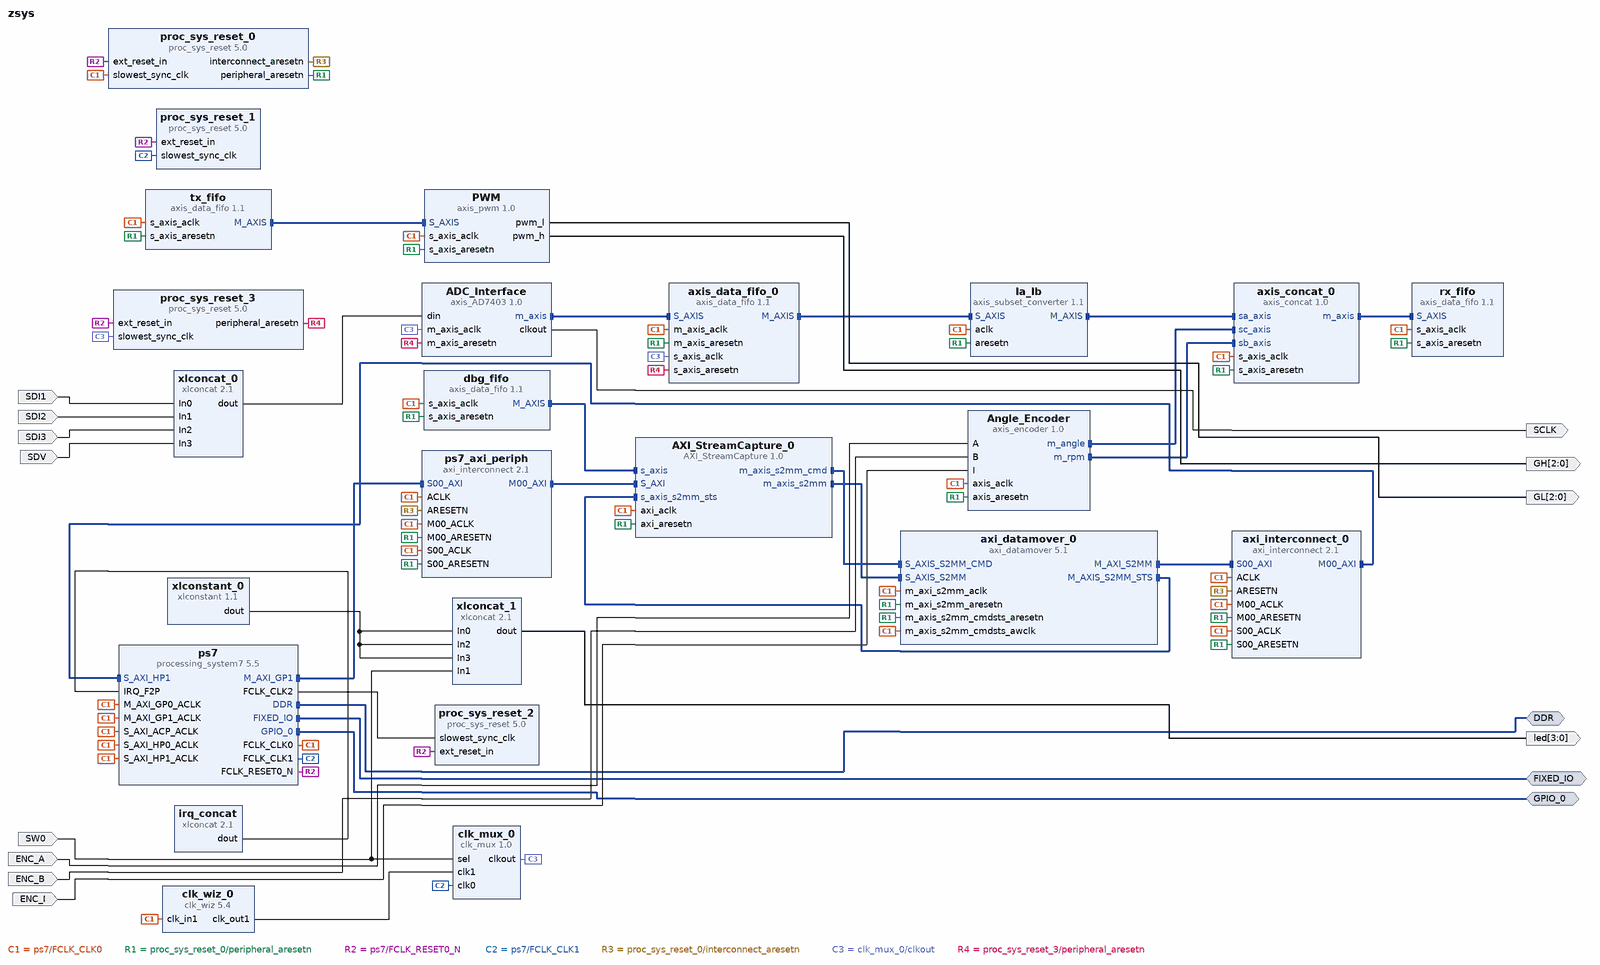
[diagram p0: block diagram of the top level]
# Vivado block design zsys, xc7z010clg400-1, Vivado 2017.1_sdx
create_bd_design zsys

create_bd_intf_port -mode Master -vlnv xilinx.com:interface:ddrx_rtl:1.0 DDR
create_bd_intf_port -mode Master -vlnv xilinx.com:display_processing_system7:fixedio_rtl:1.0 FIXED_IO
create_bd_intf_port -mode Master -vlnv xilinx.com:interface:gpio_rtl:1.0 GPIO_0
create_bd_port -dir I ENC_A
create_bd_port -dir I ENC_B
create_bd_port -dir I SDI1
create_bd_port -dir I SDI2
create_bd_port -dir I SDI3
create_bd_port -dir I SDV
create_bd_port -dir O SCLK
create_bd_port -dir O -from 2 -to 0 GL
create_bd_port -dir O -from 2 -to 0 GH
create_bd_port -dir I ENC_I
create_bd_port -dir O -from 3 -to 0 led
create_bd_port -dir I SW0

create_bd_cell -type ip -vlnv trenz.biz:user:axis_concat:1.0 axis_concat_0
set_property -dict {CONFIG.C_A_TDATA_WIDTH 32 CONFIG.M_TDATA_WIDTH 64 CONFIG.C_IN_CHANNELS 3} [get_bd_cells axis_concat_0]
create_bd_cell -type ip -vlnv xilinx.com:ip:axis_data_fifo:1.1 rx_fifo
set_property -dict {CONFIG.TDATA_NUM_BYTES 8 CONFIG.FIFO_DEPTH 512 CONFIG.IS_ACLK_ASYNC 0} [get_bd_cells rx_fifo]
create_bd_cell -type ip -vlnv xilinx.com:ip:processing_system7:5.5 ps7
set_property -dict [list \
  CONFIG.PCW_FCLK_CLK2_BUF TRUE \
  CONFIG.PCW_UIPARAM_DDR_FREQ_MHZ 525 \
  CONFIG.PCW_CRYSTAL_PERIPHERAL_FREQMHZ 50 \
  CONFIG.PCW_APU_PERIPHERAL_FREQMHZ 650 \
  CONFIG.PCW_SDIO_PERIPHERAL_FREQMHZ 50 \
  CONFIG.PCW_UART_PERIPHERAL_FREQMHZ 100 \
  CONFIG.PCW_FPGA0_PERIPHERAL_FREQMHZ 100 \
  CONFIG.PCW_FPGA1_PERIPHERAL_FREQMHZ 20 \
  CONFIG.PCW_USE_M_AXI_GP1 1 \
  CONFIG.PCW_USE_S_AXI_ACP 1 \
  CONFIG.PCW_USE_S_AXI_HP0 1 \
  CONFIG.PCW_USE_S_AXI_HP1 1 \
  CONFIG.PCW_M_AXI_GP0_FREQMHZ 10 \
  CONFIG.PCW_S_AXI_HP0_FREQMHZ 10 \
  CONFIG.PCW_USE_FABRIC_INTERRUPT 1 \
  CONFIG.PCW_GPIO_EMIO_GPIO_WIDTH 2 \
  CONFIG.PCW_EN_CLK1_PORT 1 \
  CONFIG.PCW_EN_CLK2_PORT 1 \
  CONFIG.PCW_IRQ_F2P_INTR 1 \
  CONFIG.PCW_PERIPHERAL_BOARD_PRESET None \
  CONFIG.PCW_PRESET_BANK1_VOLTAGE {LVCMOS 1.8V} \
  CONFIG.PCW_UIPARAM_DDR_BUS_WIDTH {16 Bit} \
  CONFIG.PCW_UIPARAM_DDR_PARTNO {MT41J256M16 RE-125} \
  CONFIG.PCW_QSPI_PERIPHERAL_ENABLE 1 \
  CONFIG.PCW_QSPI_QSPI_IO {MIO 1 .. 6} \
  CONFIG.PCW_QSPI_GRP_SINGLE_SS_ENABLE 1 \
  CONFIG.PCW_QSPI_GRP_SINGLE_SS_IO {MIO 1 .. 6} \
  CONFIG.PCW_QSPI_GRP_FBCLK_ENABLE 1 \
  CONFIG.PCW_QSPI_GRP_FBCLK_IO {MIO 8} \
  CONFIG.PCW_ENET0_PERIPHERAL_ENABLE 1 \
  CONFIG.PCW_ENET0_ENET0_IO {MIO 16 .. 27} \
  CONFIG.PCW_ENET0_GRP_MDIO_ENABLE 1 \
  CONFIG.PCW_ENET0_GRP_MDIO_IO {MIO 52 .. 53} \
  CONFIG.PCW_ENET_RESET_ENABLE 1 \
  CONFIG.PCW_ENET_RESET_SELECT {Share reset pin} \
  CONFIG.PCW_ENET0_RESET_ENABLE 1 \
  CONFIG.PCW_ENET0_RESET_IO {MIO 9} \
  CONFIG.PCW_SD0_PERIPHERAL_ENABLE 1 \
  CONFIG.PCW_SD0_SD0_IO {MIO 40 .. 45} \
  CONFIG.PCW_SD0_GRP_CD_ENABLE 1 \
  CONFIG.PCW_SD0_GRP_CD_IO {MIO 47} \
  CONFIG.PCW_SD0_GRP_WP_ENABLE 0 \
  CONFIG.PCW_UART0_PERIPHERAL_ENABLE 1 \
  CONFIG.PCW_UART0_UART0_IO {MIO 14 .. 15} \
  CONFIG.PCW_UART1_PERIPHERAL_ENABLE 1 \
  CONFIG.PCW_UART1_UART1_IO {MIO 48 .. 49} \
  CONFIG.PCW_USB0_PERIPHERAL_ENABLE 0 \
  CONFIG.PCW_USB_RESET_ENABLE 1 \
  CONFIG.PCW_I2C_RESET_ENABLE 1 \
  CONFIG.PCW_GPIO_MIO_GPIO_ENABLE 1 \
  CONFIG.PCW_GPIO_MIO_GPIO_IO MIO \
  CONFIG.PCW_GPIO_EMIO_GPIO_ENABLE 1 \
  CONFIG.PCW_GPIO_EMIO_GPIO_IO 2 \
  CONFIG.PCW_FPGA_FCLK1_ENABLE 1 \
  CONFIG.PCW_FPGA_FCLK2_ENABLE 1 \
] [get_bd_cells ps7]
# 512 more settings of ps7 are not shown: defaults, MIO pin electricals, DDR timing, and values the tool derives
create_bd_cell -type ip -vlnv xilinx.com:ip:axis_data_fifo:1.1 tx_fifo
set_property -dict {CONFIG.TDATA_NUM_BYTES 8 CONFIG.IS_ACLK_ASYNC 0} [get_bd_cells tx_fifo]
create_bd_cell -type ip -vlnv xilinx.com:ip:xlconcat:2.1 xlconcat_0
set_property -dict {CONFIG.NUM_PORTS 4 CONFIG.dout_width 4} [get_bd_cells xlconcat_0]
create_bd_cell -type ip -vlnv xilinx.com:ip:xlconcat:2.1 irq_concat
set_property -dict {CONFIG.NUM_PORTS 1 CONFIG.dout_width 1} [get_bd_cells irq_concat]
create_bd_cell -type ip -vlnv xilinx.com:ip:axis_subset_converter:1.1 Ia_Ib
set_property -dict {CONFIG.S_TDATA_NUM_BYTES 8 CONFIG.M_TDATA_NUM_BYTES 4 CONFIG.TDATA_REMAP {tdata[31:0]}} [get_bd_cells Ia_Ib]
create_bd_cell -type ip -vlnv xilinx.com:ip:proc_sys_reset:5.0 proc_sys_reset_0
create_bd_cell -type ip -vlnv xilinx.com:ip:proc_sys_reset:5.0 proc_sys_reset_1
create_bd_cell -type ip -vlnv xilinx.com:ip:proc_sys_reset:5.0 proc_sys_reset_2
create_bd_cell -type ip -vlnv trenz.biz:user:axis_encoder:1.0 Angle_Encoder
set_property -dict [list \
  CONFIG.C_M_AXIS_TDATA_WIDTH 16 \
  CONFIG.C_CPR 1000 \
  CONFIG.C_ANGLE_AXIS true \
  CONFIG.C_PERIOD_AXIS false \
  CONFIG.C_RPM_AXIS true \
  CONFIG.C_USE_SHIFT false \
  CONFIG.C_INVERS_DIR false \
] [get_bd_cells Angle_Encoder]
create_bd_cell -type ip -vlnv xilinx.com:ip:axi_datamover:5.1 axi_datamover_0
set_property -dict [list \
  CONFIG.c_s2mm_support_indet_btt true \
  CONFIG.c_m_axi_s2mm_id_width 0 \
  CONFIG.c_enable_mm2s 0 \
] [get_bd_cells axi_datamover_0]
create_bd_cell -type ip -vlnv xilinx.com:ip:axi_interconnect:2.1 ps7_axi_periph
set_property -dict {CONFIG.NUM_MI 1} [get_bd_cells ps7_axi_periph]
create_bd_cell -type ip -vlnv xilinx.com:ip:axi_interconnect:2.1 axi_interconnect_0
set_property -dict {CONFIG.NUM_MI 1} [get_bd_cells axi_interconnect_0]
create_bd_cell -type ip -vlnv xilinx.com:ip:axis_data_fifo:1.1 dbg_fifo
set_property -dict {CONFIG.TDATA_NUM_BYTES 8 CONFIG.FIFO_DEPTH 8192} [get_bd_cells dbg_fifo]
create_bd_cell -type ip -vlnv trenz.biz:user:axis_pwm:1.0 PWM
set_property -dict [list \
  CONFIG.C_S_AXIS_TDATA_WIDTH 64 \
  CONFIG.C_CHANNELS 3 \
  CONFIG.C_DEADTIME_SYCLES 50 \
  CONFIG.C_IN_TYPE 1 \
] [get_bd_cells PWM]
create_bd_cell -type ip -vlnv xilinx.com:ip:clk_wiz:5.4 clk_wiz_0
set_property -dict [list \
  CONFIG.USE_SPREAD_SPECTRUM true \
  CONFIG.PRIM_IN_FREQ 100.000 \
  CONFIG.CLKOUT1_REQUESTED_OUT_FREQ 20 \
  CONFIG.CLKOUT1_REQUESTED_DUTY_CYCLE 50.0 \
  CONFIG.USE_LOCKED false \
  CONFIG.USE_RESET false \
  CONFIG.MMCM_DIVCLK_DIVIDE 3 \
  CONFIG.MMCM_BANDWIDTH LOW \
  CONFIG.MMCM_CLKFBOUT_MULT_F 21.000 \
  CONFIG.MMCM_CLKOUT0_DIVIDE_F 35.000 \
  CONFIG.CLKOUT1_JITTER 316.694 \
  CONFIG.CLKOUT1_PHASE_ERROR 732.678 \
] [get_bd_cells clk_wiz_0]
create_bd_cell -type ip -vlnv xilinx.com:ip:xlconcat:2.1 xlconcat_1
set_property -dict [list \
  CONFIG.NUM_PORTS 4 \
  CONFIG.IN0_WIDTH 1 \
  CONFIG.IN1_WIDTH 1 \
  CONFIG.IN2_WIDTH 1 \
  CONFIG.IN3_WIDTH 1 \
] [get_bd_cells xlconcat_1]
create_bd_cell -type ip -vlnv xilinx.com:ip:xlconstant:1.1 xlconstant_0
set_property -dict {CONFIG.CONST_VAL 0} [get_bd_cells xlconstant_0]
create_bd_cell -type ip -vlnv trenz.biz:user:clk_mux:1.0 clk_mux_0
create_bd_cell -type ip -vlnv xilinx.com:ip:proc_sys_reset:5.0 proc_sys_reset_3
create_bd_cell -type ip -vlnv xilinx.com:ip:axis_data_fifo:1.1 axis_data_fifo_0
set_property -dict {CONFIG.IS_ACLK_ASYNC 1} [get_bd_cells axis_data_fifo_0]
create_bd_cell -type ip -vlnv trenz.biz:user:AXI_StreamCapture:1.0 AXI_StreamCapture_0
create_bd_cell -type ip -vlnv trenz.biz:user:axis_AD7403:1.0 ADC_Interface
set_property -dict [list \
  CONFIG.C_DECIMATION 128 \
  CONFIG.C_CLOCK_RATIO 1 \
  CONFIG.C_M_AXIS_TDATA_WIDTH 64 \
  CONFIG.C_OUT_TYPE 1 \
  CONFIG.C_SIGNED true \
] [get_bd_cells ADC_Interface]

# ---- connections ----

connect_bd_intf_net [get_bd_intf_pins tx_fifo/M_AXIS] [get_bd_intf_pins PWM/S_AXIS]
connect_bd_intf_net [get_bd_intf_pins axis_concat_0/m_axis] [get_bd_intf_pins rx_fifo/S_AXIS]
connect_bd_intf_net [get_bd_intf_pins Angle_Encoder/m_angle] [get_bd_intf_pins axis_concat_0/sc_axis]
connect_bd_intf_net [get_bd_intf_pins Angle_Encoder/m_rpm] [get_bd_intf_pins axis_concat_0/sb_axis]
connect_bd_intf_net -intf_net axis_subset_converter_0_M_AXIS [get_bd_intf_pins Ia_Ib/M_AXIS] [get_bd_intf_pins axis_concat_0/sa_axis]
connect_bd_intf_net [get_bd_intf_pins AXI_StreamCapture_0/m_axis_s2mm_cmd] [get_bd_intf_pins axi_datamover_0/S_AXIS_S2MM_CMD]
connect_bd_intf_net [get_bd_intf_pins AXI_StreamCapture_0/m_axis_s2mm] [get_bd_intf_pins axi_datamover_0/S_AXIS_S2MM]
connect_bd_intf_net [get_bd_intf_pins axi_datamover_0/M_AXIS_S2MM_STS] [get_bd_intf_pins AXI_StreamCapture_0/s_axis_s2mm_sts]
connect_bd_intf_net [get_bd_intf_pins ps7_axi_periph/M00_AXI] [get_bd_intf_pins AXI_StreamCapture_0/S_AXI]
connect_bd_intf_net -intf_net axis_data_fifo_0_M_AXIS [get_bd_intf_pins dbg_fifo/M_AXIS] [get_bd_intf_pins AXI_StreamCapture_0/s_axis]
connect_bd_intf_net [get_bd_intf_pins ps7/M_AXI_GP1] [get_bd_intf_pins ps7_axi_periph/S00_AXI]
connect_bd_intf_net [get_bd_intf_pins axi_interconnect_0/M00_AXI] [get_bd_intf_pins ps7/S_AXI_HP1]
connect_bd_intf_net [get_bd_intf_pins axi_interconnect_0/S00_AXI] [get_bd_intf_pins axi_datamover_0/M_AXI_S2MM]
connect_bd_intf_net [get_bd_intf_pins axis_data_fifo_0/S_AXIS] [get_bd_intf_pins ADC_Interface/m_axis]
connect_bd_intf_net [get_bd_intf_pins axis_data_fifo_0/M_AXIS] [get_bd_intf_pins Ia_Ib/S_AXIS]
connect_bd_intf_net -intf_net processing_system7_0_DDR [get_bd_intf_ports DDR] [get_bd_intf_pins ps7/DDR]
connect_bd_intf_net -intf_net processing_system7_0_FIXED_IO [get_bd_intf_ports FIXED_IO] [get_bd_intf_pins ps7/FIXED_IO]
connect_bd_intf_net -intf_net processing_system7_0_GPIO_0 [get_bd_intf_ports GPIO_0] [get_bd_intf_pins ps7/GPIO_0]
connect_bd_net -net processing_system7_0_FCLK_CLK0 [get_bd_pins ps7/FCLK_CLK0] \
  [get_bd_pins axis_concat_0/s_axis_aclk] [get_bd_pins rx_fifo/s_axis_aclk] [get_bd_pins ps7/M_AXI_GP0_ACLK] \
  [get_bd_pins ps7/S_AXI_ACP_ACLK] [get_bd_pins ps7/S_AXI_HP0_ACLK] [get_bd_pins tx_fifo/s_axis_aclk] \
  [get_bd_pins Ia_Ib/aclk] [get_bd_pins proc_sys_reset_0/slowest_sync_clk] [get_bd_pins Angle_Encoder/axis_aclk] \
  [get_bd_pins axi_datamover_0/m_axi_s2mm_aclk] [get_bd_pins axi_datamover_0/m_axis_s2mm_cmdsts_awclk] \
  [get_bd_pins dbg_fifo/s_axis_aclk] [get_bd_pins ps7/M_AXI_GP1_ACLK] [get_bd_pins ps7/S_AXI_HP1_ACLK] \
  [get_bd_pins PWM/s_axis_aclk] [get_bd_pins clk_wiz_0/clk_in1] [get_bd_pins axis_data_fifo_0/m_axis_aclk] \
  [get_bd_pins ps7_axi_periph/S00_ACLK] [get_bd_pins ps7_axi_periph/M00_ACLK] [get_bd_pins ps7_axi_periph/ACLK] \
  [get_bd_pins axi_interconnect_0/S00_ACLK] [get_bd_pins axi_interconnect_0/M00_ACLK] [get_bd_pins axi_interconnect_0/ACLK] \
  [get_bd_pins AXI_StreamCapture_0/axi_aclk]
connect_bd_net -net A_1 [get_bd_ports ENC_A] [get_bd_pins Angle_Encoder/A]
connect_bd_net -net B_1 [get_bd_ports ENC_B] [get_bd_pins Angle_Encoder/B]
connect_bd_net [get_bd_pins proc_sys_reset_0/peripheral_aresetn] \
  [get_bd_pins axis_concat_0/s_axis_aresetn] [get_bd_pins rx_fifo/s_axis_aresetn] [get_bd_pins tx_fifo/s_axis_aresetn] \
  [get_bd_pins Ia_Ib/aresetn] [get_bd_pins Angle_Encoder/axis_aresetn] [get_bd_pins axi_datamover_0/m_axi_s2mm_aresetn] \
  [get_bd_pins axi_datamover_0/m_axis_s2mm_cmdsts_aresetn] [get_bd_pins dbg_fifo/s_axis_aresetn] \
  [get_bd_pins PWM/s_axis_aresetn] [get_bd_pins axis_data_fifo_0/m_axis_aresetn] [get_bd_pins ps7_axi_periph/S00_ARESETN] \
  [get_bd_pins ps7_axi_periph/M00_ARESETN] [get_bd_pins axi_interconnect_0/M00_ARESETN] \
  [get_bd_pins axi_interconnect_0/S00_ARESETN] [get_bd_pins AXI_StreamCapture_0/axi_aresetn]
connect_bd_net -net processing_system7_0_FCLK_RESET0_N [get_bd_pins ps7/FCLK_RESET0_N] \
  [get_bd_pins proc_sys_reset_0/ext_reset_in] [get_bd_pins proc_sys_reset_1/ext_reset_in] \
  [get_bd_pins proc_sys_reset_2/ext_reset_in] [get_bd_pins proc_sys_reset_3/ext_reset_in]
connect_bd_net -net SDI1_1 [get_bd_ports SDI1] [get_bd_pins xlconcat_0/In0]
connect_bd_net -net SDI2_1 [get_bd_ports SDI2] [get_bd_pins xlconcat_0/In1]
connect_bd_net -net SDI3_1 [get_bd_ports SDI3] [get_bd_pins xlconcat_0/In2]
connect_bd_net [get_bd_ports SDV] [get_bd_pins xlconcat_0/In3]
connect_bd_net -net adc_din [get_bd_pins xlconcat_0/dout] [get_bd_pins ADC_Interface/din]
connect_bd_net -net axis_AD7403_0_clkout [get_bd_pins ADC_Interface/clkout] [get_bd_ports SCLK]
connect_bd_net -net axis_pwm_0_pwm_l [get_bd_pins PWM/pwm_l] [get_bd_ports GL]
connect_bd_net -net axis_pwm_0_pwm_h [get_bd_pins PWM/pwm_h] [get_bd_ports GH]
connect_bd_net [get_bd_ports ENC_I] [get_bd_pins Angle_Encoder/I]
connect_bd_net -net irq_concat [get_bd_pins irq_concat/dout] [get_bd_pins ps7/IRQ_F2P]
connect_bd_net -net processing_system7_0_FCLK_CLK1 [get_bd_pins ps7/FCLK_CLK1] \
  [get_bd_pins proc_sys_reset_1/slowest_sync_clk] [get_bd_pins clk_mux_0/clk0]
connect_bd_net -net processing_system7_0_FCLK_CLK2 [get_bd_pins ps7/FCLK_CLK2] [get_bd_pins proc_sys_reset_2/slowest_sync_clk]
connect_bd_net [get_bd_pins proc_sys_reset_0/interconnect_aresetn] [get_bd_pins ps7_axi_periph/ARESETN] [get_bd_pins axi_interconnect_0/ARESETN]
connect_bd_net [get_bd_pins xlconcat_1/dout] [get_bd_ports led]
connect_bd_net -net SW0_1 [get_bd_ports SW0] [get_bd_pins xlconcat_1/In1] [get_bd_pins clk_mux_0/sel]
connect_bd_net [get_bd_pins xlconstant_0/dout] [get_bd_pins xlconcat_1/In3] [get_bd_pins xlconcat_1/In2] [get_bd_pins xlconcat_1/In0]
connect_bd_net [get_bd_pins clk_wiz_0/clk_out1] [get_bd_pins clk_mux_0/clk1]
connect_bd_net [get_bd_pins clk_mux_0/clkout] \
  [get_bd_pins proc_sys_reset_3/slowest_sync_clk] [get_bd_pins axis_data_fifo_0/s_axis_aclk] \
  [get_bd_pins ADC_Interface/m_axis_aclk]
connect_bd_net [get_bd_pins proc_sys_reset_3/peripheral_aresetn] \
  [get_bd_pins axis_data_fifo_0/s_axis_aresetn] [get_bd_pins ADC_Interface/m_axis_aresetn]

# ---- address map ----
assign_bd_address -offset 0x00000000 -range 512M -target_address_space [get_bd_addr_spaces axi_datamover_0/Data_S2MM] [get_bd_addr_segs ps7/S_AXI_HP1/HP1_DDR_LOWOCM]
assign_bd_address -offset 0x83C00000 -range 64K -target_address_space [get_bd_addr_spaces ps7/Data] [get_bd_addr_segs AXI_StreamCapture_0/S_AXI/S_AXI_reg]

validate_bd_design
save_bd_design
